# Altium schematic sheet Sheet3.SchDoc
size A; SheetNumber: 1; SheetTotal: 3
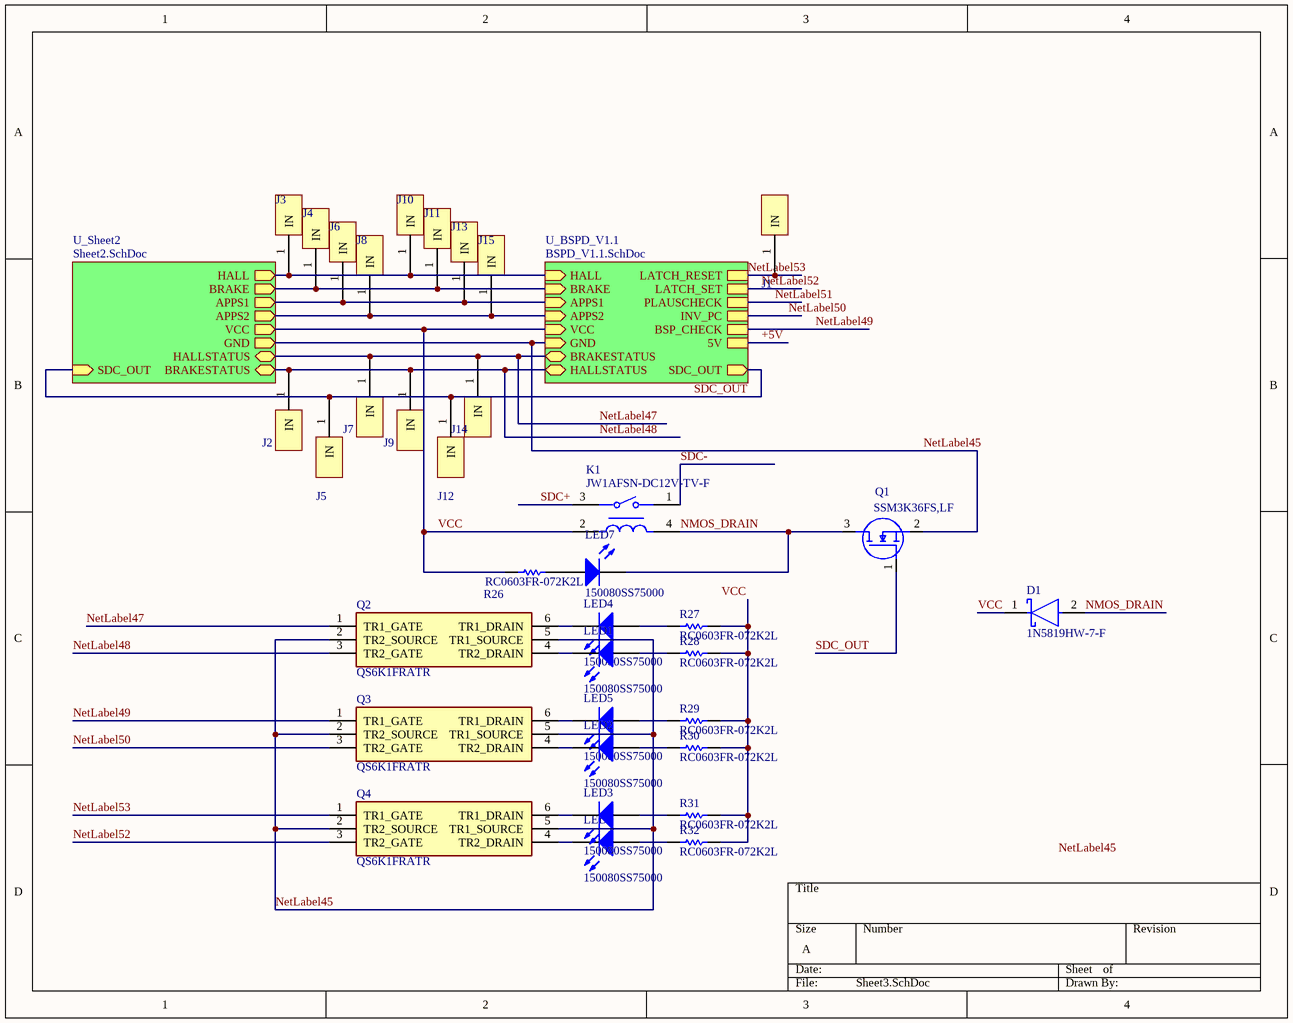
[diagram p0: Sheet3.SchDoc]

## Parts
D1  1N5819HW-7-F  [FP-SOD123-IPC_A]
J1  22AWG JUMPER  [22 AWG Hole]  (value not drawn)
J2  22AWG JUMPER  [22 AWG Hole]  (value not drawn)
J3  22AWG JUMPER  [22 AWG Hole]  (value not drawn)
J4  22AWG JUMPER  [22 AWG Hole]  (value not drawn)
J5  22AWG JUMPER  [22 AWG Hole]  (value not drawn)
J6  22AWG JUMPER  [22 AWG Hole]  (value not drawn)
J7  22AWG JUMPER  [22 AWG Hole]  (value not drawn)
J8  22AWG JUMPER  [22 AWG Hole]  (value not drawn)
J9  22AWG JUMPER  [22 AWG Hole]  (value not drawn)
J10  22AWG JUMPER  [22 AWG Hole]  (value not drawn)
J11  22AWG JUMPER  [22 AWG Hole]  (value not drawn)
J12  22AWG JUMPER  [22 AWG Hole]  (value not drawn)
J13  22AWG JUMPER  [22 AWG Hole]  (value not drawn)
J14  22AWG JUMPER  [22 AWG Hole]  (value not drawn)
J15  22AWG JUMPER  [22 AWG Hole]  (value not drawn)
K1  JW1AFSN-DC12V-TV-F  [FP-JW1AFSN-DC12V-TV-F-MFG]
LED1  150080SS75000  [0805_A]
LED2  150080SS75000  [0805_A]
LED3  150080SS75000  [0805_A]
LED4  150080SS75000  [0805_A]
LED5  150080SS75000  [0805_A]
LED6  150080SS75000  [0805_A]
LED7  150080SS75000  [0805_A]
Q1  SSM3K36FS,LF  [1SS423]
Q2  QS6K1FRATR  [SOT95P280X100-6N]
Q3  QS6K1FRATR  [SOT95P280X100-6N]
Q4  QS6K1FRATR  [SOT95P280X100-6N]
R26  RC0603FR-072K2L  [RESC1608X55X25LL10T15]
R27  RC0603FR-072K2L  [RESC1608X55X25LL10T15]
R28  RC0603FR-072K2L  [RESC1608X55X25LL10T15]
R29  RC0603FR-072K2L  [RESC1608X55X25LL10T15]
R30  RC0603FR-072K2L  [RESC1608X55X25LL10T15]
R31  RC0603FR-072K2L  [RESC1608X55X25LL10T15]
R32  RC0603FR-072K2L  [RESC1608X55X25LL10T15]

## Sub-sheets
U_BSPD_V1.1 = BSPD_V1.1.SchDoc: SDC_OUT (out), HALL (in), BRAKE (in), APPS1 (in), APPS2 (in), VCC (in), GND (in), BRAKESTATUS (bidir), HALLSTATUS (bidir), LATCH_RESET, LATCH_SET, PLAUSCHECK, INV_PC, BSP_CHECK, 5V
U_Sheet2 = Sheet2.SchDoc: SDC_OUT (in), HALL (out), BRAKE (out), APPS1 (out), APPS2 (out), VCC (out), GND (out), BRAKESTATUS (bidir), HALLSTATUS (bidir)

## Nets
+5V: sheet U_BSPD_V1.1/5V
NetLabel45: Q1.2(S) Q2.2(TR2_SOURCE) Q2.5(TR1_SOURCE) Q3.2(TR2_SOURCE) Q3.5(TR1_SOURCE) Q4.2(TR2_SOURCE) Q4.5(TR1_SOURCE) ; sheet U_BSPD_V1.1/GND, sheet U_Sheet2/GND
NetLabel47: J7.1(IN) J14.1(IN) Q2.1(TR1_GATE) ; sheet U_BSPD_V1.1/BRAKESTATUS, sheet U_Sheet2/HALLSTATUS
NetLabel48: J2.1(IN) J9.1(IN) Q2.3(TR2_GATE) ; sheet U_BSPD_V1.1/HALLSTATUS, sheet U_Sheet2/BRAKESTATUS
NetLabel49: Q3.1(TR1_GATE) ; sheet U_BSPD_V1.1/BSP_CHECK
NetLabel50: Q3.3(TR2_GATE) ; sheet U_BSPD_V1.1/INV_PC
NetLabel51: sheet U_BSPD_V1.1/PLAUSCHECK
NetLabel52: Q4.3(TR2_GATE) ; sheet U_BSPD_V1.1/LATCH_SET
NetLabel53: J1.1(IN) Q4.1(TR1_GATE) ; sheet U_BSPD_V1.1/LATCH_RESET
NMOS_DRAIN: D1.2(A) K1.4 LED7.1(K) Q1.3(D)
SDC+: K1.3
SDC-: K1.1
SDC_OUT: J5.1(IN) J12.1(IN) Q1.1(G) ; sheet U_BSPD_V1.1/SDC_OUT, sheet U_Sheet2/SDC_OUT
VCC: D1.1(C) K1.2 R26.1 R27.2 R28.2 R29.2 R30.2 R31.2 R32.2 ; sheet U_BSPD_V1.1/VCC, sheet U_Sheet2/VCC
NetJ3_1: J3.1(IN) J10.1(IN) ; sheet U_BSPD_V1.1/HALL, sheet U_Sheet2/HALL
NetJ4_1: J4.1(IN) J11.1(IN) ; sheet U_BSPD_V1.1/BRAKE, sheet U_Sheet2/BRAKE
NetJ6_1: J6.1(IN) J13.1(IN) ; sheet U_BSPD_V1.1/APPS1, sheet U_Sheet2/APPS1
NetJ8_1: J8.1(IN) J15.1(IN) ; sheet U_BSPD_V1.1/APPS2, sheet U_Sheet2/APPS2
NetLED1_1: LED1.1(K) Q2.4(TR2_DRAIN)
NetLED1_2: LED1.2(A) R28.1
NetLED2_1: LED2.1(K) Q3.4(TR2_DRAIN)
NetLED2_2: LED2.2(A) R30.1
NetLED3_1: LED3.1(K) Q4.6(TR1_DRAIN)
NetLED3_2: LED3.2(A) R31.1
NetLED4_1: LED4.1(K) Q2.6(TR1_DRAIN)
NetLED4_2: LED4.2(A) R27.1
NetLED5_1: LED5.1(K) Q3.6(TR1_DRAIN)
NetLED5_2: LED5.2(A) R29.1
NetLED6_1: LED6.1(K) Q4.4(TR2_DRAIN)
NetLED6_2: LED6.2(A) R32.1
NetLED7_2: LED7.2(A) R26.2

## Notes on the sheet
- Labels drawn without touching a wire or pin: NetLabel45

## Library data of the parts
D1 = CMP-0303-00003-3: DIODE SCHOTTKY 40V 1A SOD123; Forward Voltage: 450mV; Capacitance: 110pF; Max Forward Surge Current (Ifsm): 25A; Peak Reverse Current: 50uA; Polarity: Standard; Element Configuration: Single; Max Power Dissipation: 450mW; Min Operating Temperature: -65°C; Package Quantity: 3000; Contact Plating: Tin; Weight: 0.000353oz; Max Repetitive Reverse Voltage (Vrrm): 40V; Max Reverse Voltage (DC): 40V; Height: 1.25mm; Average Rectified Current: 1A; Width: 1.7mm; Case/Package: SOD-123-2; Lead Free: Lead Free; Max Operating Temperature: 125°C; Current Rating: 1A; Termination: SMD/SMT; Forward Current: 1A; Radiation Hardening: No; Number of Pins: 2; Length: 2.85mm; Voltage Rating (DC): 40V; REACH SVHC: No SVHC; Peak Non-Repetitive Surge Current: 25A; Packaging: Tape and Reel; Output Current: 1A
K1 = CMP-05606-000032-1: RELAY GEN PURPOSE SPST 10A 12V; Coil Current: 44mA; Life (Hours): 5Hour; Operate Time: 15ms; Coil Type: Non-Latching; Coil Resistance: 270R; Coil Power: 530mW; Max Voltage Rating (DC): 30V; Relay Type: General Purpose; Release Time: 5ms; Max Voltage Rating (AC): 250V; Mount: Through Hole; Contact Material: Tin; Depth: 28.6mm; Series: JW; Number of Pins: 4; Weight: 13g; Contact Current Rating: 10A; Throw Configuration: SPST; Coil Voltage (DC): 12V; Max Current Rating: 10A; Height: 20mm; Packaging: Bulk; Package Quantity: 100; Termination: PC Pin; Length: 12.8mm; Max Operating Temperature: 60°C; Min Operating Temperature: -40°C; Current Rating: 10A
LED1-LED7 = CMP-1426-00010-1: SMD mono-color Chip LED, WL-SMCW, Super Red; Manufacturer: Wuerth Elektronik; PackageReference: 0805_A; ComponentLink2URL: http://katalog.we-online.com/led/datasheet/150080SS75000.pdf; ComponentLink1URL: http://www.we-online.com; Color: Super Red; ComponentLink2Description: Datasheet; ComponentLink1Description: Manufacturer URL; PartNumber: 150080SS75000
Q1 = SSM3K36FS,LF: MOSFET (N-Channel); Manufacturer_Name: Toshiba; Datasheet Link: http://toshiba.semicon-storage.com/info/docget.jsp?did=11220&prodName=SSM3K36FS; Height: 0mm; Manufacturer_Part_Number: SSM3K36FS,LF; Mouser Part Number: 757-SSM3K36FSLF; Mouser Price/Stock: https://www.mouser.co.uk/ProductDetail/Toshiba/SSM3K36FSLF?qs=rsevcuukUAyNuioVUhNFrQ%3D%3D; Arrow Part Number: SSM3K36FS,LF; Arrow Price/Stock: https://www.arrow.com/en/products/ssm3k36fslf/toshiba
Q2-Q4 = QS6K1FRATR: MOSFET (N-Channel); Manufacturer_Name: ROHM Semiconductor; Datasheet Link: https://www.rohm.com/products/mosfets/automotive/dual/qs6k1fra-product; Height: 1mm; Manufacturer_Part_Number: QS6K1FRATR; Mouser Part Number: 755-QS6K1FRATR; Mouser Price/Stock: https://www.mouser.co.uk/ProductDetail/ROHM-Semiconductor/QS6K1FRATR?qs=4v%252BiZTmLVHGPs3XXnzhw7A%3D%3D
R26-R32 = CMP-2000-06934-1: Thick Film Resistor, 2.2 KOhm, 100 mW, 50 V, +/- 1%, -55 to 155 degC, 2-Pin SMD (0603), RoHS, Tape and Reel; Manufacturer: Yageo; Resistance: 2.2kOhms; Temperature Coefficient: 100PPM/C; Voltage Rating: 50V; Power Rating: 100mW; Tolerance: 1%; Datasheet Version: Rev. 7, 05/2017; Case Code - mm: 1608; Series: RC; Mounting Technology: SurfaceMount; Package Description: 2-Pin Surface Mount Device, Body 1.6 x 0.8 mm; Case Code - in: 0603; Package Reference: 0603; Product: ThickFilmResistorsGeneralPurpose; Manufacturer URL: http://www.yageo.com/; Termination Style: SMD/SMT; Operating Temperature Range: -55Cto+155C; Datasheet URL: http://www.yageo.com/documents/recent/PYu-RC_Group_51_RoHS_L_7.pdf; Packaging: Reel